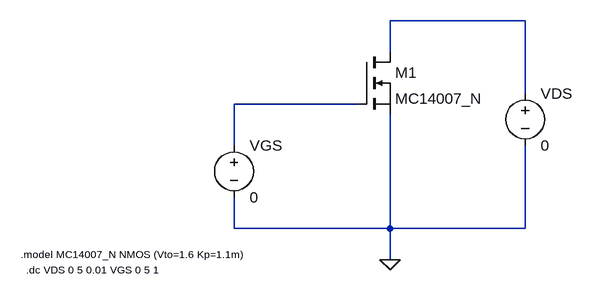
[diagram p0: schematic 1.1.1.asc]
1.1.1.asc, the LTspice schematic file:
Version 4
SHEET 1 880 680
WIRE 608 -32 400 -32
WIRE 400 16 400 -32
WIRE 608 80 608 -32
WIRE 352 96 160 96
WIRE 160 160 160 96
WIRE 160 288 160 240
WIRE 400 288 400 112
WIRE 400 288 160 288
WIRE 608 288 608 160
WIRE 608 288 400 288
WIRE 400 336 400 288
FLAG 400 336 0
SYMBOL voltage 160 144 R0
WINDOW 123 0 0 Left 0
WINDOW 39 0 0 Left 0
SYMATTR InstName VGS
SYMATTR Value 0
SYMBOL voltage 608 64 R0
WINDOW 123 0 0 Left 0
WINDOW 39 0 0 Left 0
SYMATTR InstName VDS
SYMATTR Value 0
SYMBOL nmos 352 16 R0
SYMATTR InstName M1
SYMATTR Value MC14007_N
TEXT -168 328 Left 1 !.model MC14007_N NMOS (Vto=1.6 Kp=1.1m)
TEXT -160 352 Left 1 !.dc VDS 0 5 0.01 VGS 0 5 1

The netlist it stands for:
* 1.1.1.asc
VGS N002 0 0
VDS N001 0 0
M1 N001 N002 0 0 MC14007_N
.model NMOS NMOS
.model PMOS PMOS
.lib standard.mos
.model MC14007_N NMOS (Vto=1.6 Kp=1.1m)
.dc VDS 0 5 0.01 VGS 0 5 1
.backanno
.end